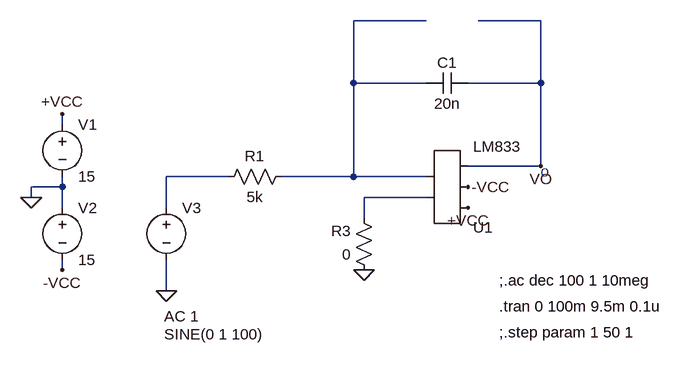
[diagram p0: schematic Integrador.asc]
Integrador.asc, the LTspice schematic file:
Version 4
SHEET 1 880 680
WIRE 384 -160 272 -160
WIRE 560 -160 464 -160
WIRE 272 -64 272 -160
WIRE 384 -64 272 -64
WIRE 560 -64 560 -160
WIRE 560 -64 448 -64
WIRE -176 0 -176 -16
WIRE 560 64 560 -64
WIRE 560 64 448 64
WIRE 80 80 -16 80
WIRE 272 80 272 -64
WIRE 272 80 160 80
WIRE 384 80 272 80
WIRE -176 96 -176 80
WIRE -176 96 -224 96
WIRE -224 112 -224 96
WIRE 384 112 288 112
WIRE -176 128 -176 96
WIRE -16 128 -16 80
WIRE 288 144 288 112
WIRE -176 224 -176 208
WIRE -16 256 -16 208
FLAG -224 112 0
FLAG -176 -16 +VCC
FLAG -176 224 -VCC
FLAG -16 256 0
FLAG 560 64 VO
FLAG 448 128 +VCC
FLAG 448 96 -VCC
FLAG 288 224 0
SYMBOL voltage -176 -16 R0
WINDOW 123 0 0 Left 0
WINDOW 39 0 0 Left 0
SYMATTR InstName V1
SYMATTR Value 15
SYMBOL voltage -176 112 R0
WINDOW 123 0 0 Left 0
WINDOW 39 0 0 Left 0
SYMATTR InstName V2
SYMATTR Value 15
SYMBOL AutoGenerated\\LM833 416 96 M180
SYMATTR InstName U1
SYMBOL voltage -16 112 R0
WINDOW 3 -3 211 Left 2
WINDOW 123 -3 183 Left 2
WINDOW 39 0 0 Left 0
SYMATTR Value SINE(0 1 100)
SYMATTR Value2 AC 1
SYMATTR InstName V3
SYMBOL cap 448 -80 R90
WINDOW 0 0 32 VBottom 2
WINDOW 3 32 32 VTop 2
SYMATTR InstName C1
SYMATTR Value 20n
SYMBOL res 176 64 R90
WINDOW 0 0 56 VBottom 2
WINDOW 3 32 56 VTop 2
SYMATTR InstName R1
SYMATTR Value 5k
SYMBOL res 304 240 R180
WINDOW 0 36 76 Left 2
WINDOW 3 36 40 Left 2
SYMATTR InstName R3
SYMATTR Value 0
TEXT 496 240 Left 2 !;.ac dec 100 1 10meg
TEXT 496 280 Left 2 !.tran 0 100m 9.5m 0.1u
TEXT 496 320 Left 2 !;.step param 1 50 1
TEXT 560 72 Left 2 ;o

The netlist it stands for:
* Integrador.asc
V1 +VCC 0 15
V2 0 -VCC 15
* U1: LM833 (symbol AutoGenerated\LM833 not available, pins judged from their places): pin1=N003 pin2=N001 pin3=+VCC pin4=-VCC pin5=VO
V3 N002 0 SINE(0 1 100) AC 1
C1 VO N001 20n
R1 N001 N002 5k
R3 0 N003 0
;.ac dec 100 1 10meg
.tran 0 100m 9.5m 0.1u
;.step param 1 50 1
* o
.backanno
.end